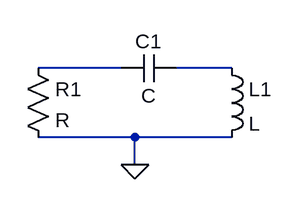
[diagram p0: schematic RLC_test.asc]
RLC_test.asc, the LTspice schematic file:
Version 4.1
SHEET 1 880 680
WIRE 208 128 112 128
WIRE 336 128 272 128
WIRE 224 208 112 208
WIRE 336 208 224 208
WIRE 224 240 224 208
FLAG 224 240 0
SYMBOL res 96 112 R0
SYMATTR InstName R1
SYMBOL cap 272 112 R90
WINDOW 0 0 32 VBottom 2
WINDOW 3 32 32 VTop 2
SYMATTR InstName C1
SYMBOL ind 320 112 R0
SYMATTR InstName L1

The netlist it stands for:
* RLC_test.asc
R1 N001 0 R
C1 N002 N001 C
L1 N002 0 L
.backanno
.end